# Altium schematic sheet Sheet7.SchDoc
size A4
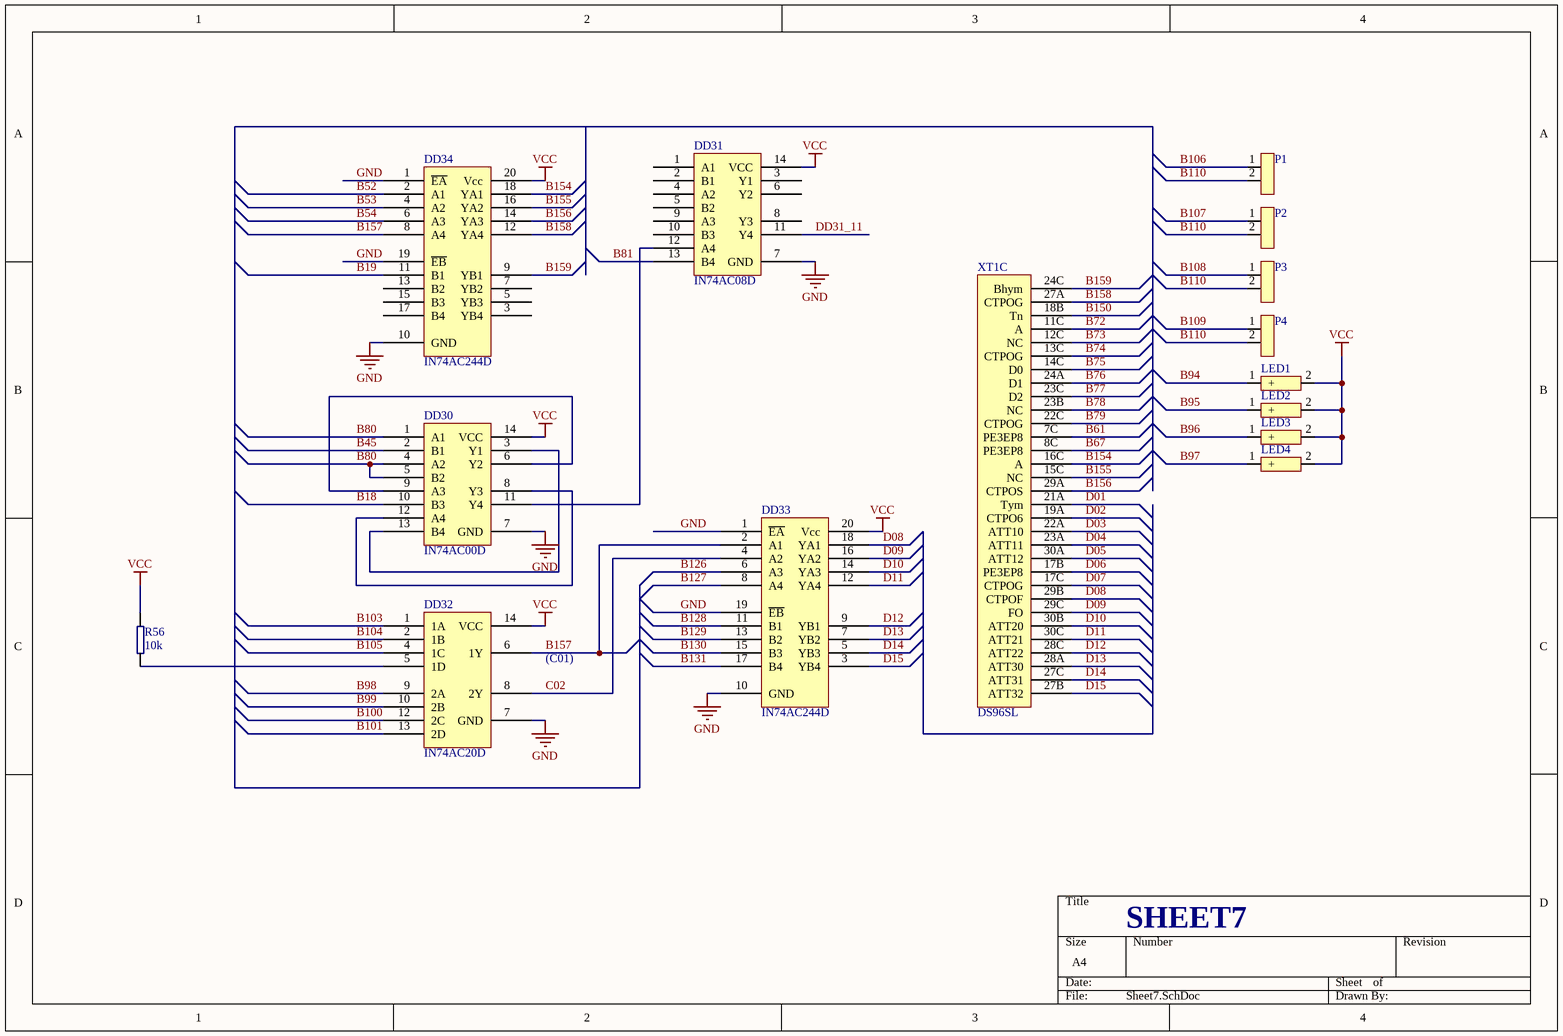
[diagram p0: Sheet7.SchDoc]

## Parts
DD30  IN74AC00D  [14 SOIC-3.9]
DD31  IN74AC08D  [14 TSSOP-4.4]
DD32  IN74AC20D  [14 SOIC-3.9]
DD33  IN74AC244D  [20 SOIC-7.5]
DD34  IN74AC244D  [20 SOIC-7.5]
LED1  LED  [LED]  (value not drawn)
LED2  LED  [LED]  (value not drawn)
LED3  LED  [LED]  (value not drawn)
LED4  LED  [LED]  (value not drawn)
P1  PIN2  [2 SIP]  (value not drawn)
P2  PIN2  [2 SIP]  (value not drawn)
P3  PIN2  [2 SIP]  (value not drawn)
P4  PIN2  [2 SIP]  (value not drawn)
R56  value 10k  [0805]  (hidden comment: R)
XT1  DS96SL  [DS96]  (part C of 3)

## Nets
GND: DD30.7(GND) DD31.7(GND) DD32.7(GND) DD33.1(~{EA}) DD33.10(GND) DD33.19(~{EB}) DD34.1(~{EA}) DD34.10(GND) DD34.19(~{EB})
VCC: DD30.14(VCC) DD31.14(VCC) DD32.14(VCC) DD33.20(Vcc) DD34.20(Vcc) LED1.2 LED2.2 LED3.2 LED4.2 R56.1
B18: DD30.10(B3)
B19: DD34.11(B1)
B45: DD30.2(B1)
B52: DD34.2(A1)
B53: DD34.4(A2)
B54: DD34.6(A3)
B61: XT1.7C(PE3EP8)
B67: XT1.8C(PE3EP8)
B72: XT1.11C(A)
B73: XT1.12C(NC)
B74: XT1.13C(CTPOG)
B75: XT1.14C(D0)
B76: XT1.24A(D1)
B77: XT1.23C(D2)
B78: XT1.23B(NC)
B79: XT1.22C(CTPOG)
B80: DD30.1(A1) DD30.4(A2) DD30.5(B2)
B81: DD31.13(B4)
B94: LED1.1(+)
B95: LED2.1(+)
B96: LED3.1(+)
B97: LED4.1(+)
B98: DD32.9(2A)
B99: DD32.10(2B)
B100: DD32.12(2C)
B101: DD32.13(2D)
B103: DD32.1(1A)
B104: DD32.2(1B)
B105: DD32.4(1C)
B106: P1.1
B107: P2.1
B108: P3.1
B109: P4.1
B110: P1.2 P2.2 P3.2 P4.2
B126: DD33.6(A3)
B127: DD33.8(A4)
B128: DD33.11(B1)
B129: DD33.13(B2)
B130: DD33.15(B3)
B131: DD33.17(B4)
B150: XT1.18B(Tn)
B154: DD34.18(YA1) XT1.16C(A)
B155: DD34.16(YA2) XT1.15C(NC)
B156: DD34.14(YA3) XT1.29A(CTPOS)
B157: DD32.6(1Y) DD33.2(A1) DD34.8(A4)
B158: DD34.12(YA4) XT1.27A(CTPOG)
B159: DD34.9(YB1) XT1.24C(Bhym)
C02: DD32.8(2Y) DD33.4(A2)
D01: XT1.21A(Tym)
D02: XT1.19A(CTPO6)
D03: XT1.22A(ATT10)
D04: XT1.23A(ATT11)
D05: XT1.30A(ATT12)
D06: XT1.17B(PE3EP8)
D07: XT1.17C(CTPOG)
D08: DD33.18(YA1) XT1.29B(CTPOF)
D09: DD33.16(YA2) XT1.29C(FO)
D10: DD33.14(YA3) XT1.30B(ATT20)
D11: DD33.12(YA4) XT1.30C(ATT21)
D12: DD33.9(YB1) XT1.28C(ATT22)
D13: DD33.7(YB2) XT1.28A(ATT30)
D14: DD33.5(YB3) XT1.27C(ATT31)
D15: DD33.3(YB4) XT1.27B(ATT32)
DD31_11: DD31.11(Y4)
NetDD30_3: DD30.3(Y1) DD30.13(B4)
NetDD30_6: DD30.6(Y2) DD30.9(A3)
NetDD30_8: DD30.8(Y3) DD30.12(A4)
NetDD30_11: DD30.11(Y4) DD31.12(A4)
NetDD32_5: DD32.5(1D) R56.2

Not connected (* = marked no-connect by the designer): DD31 1(A1) 2(B1) 3(Y1) 4(A2) 5(B2) 6(Y2) 8(Y3) 9(A3) 10(B3); DD34 3(YB4) 5(YB3) 7(YB2) 13(B2) 15(B3) 17(B4)

## Notes on the sheet
- (C01)
- SHEET7